# EAGLE design StickSoc_Right (EAGLE 6.6.0)
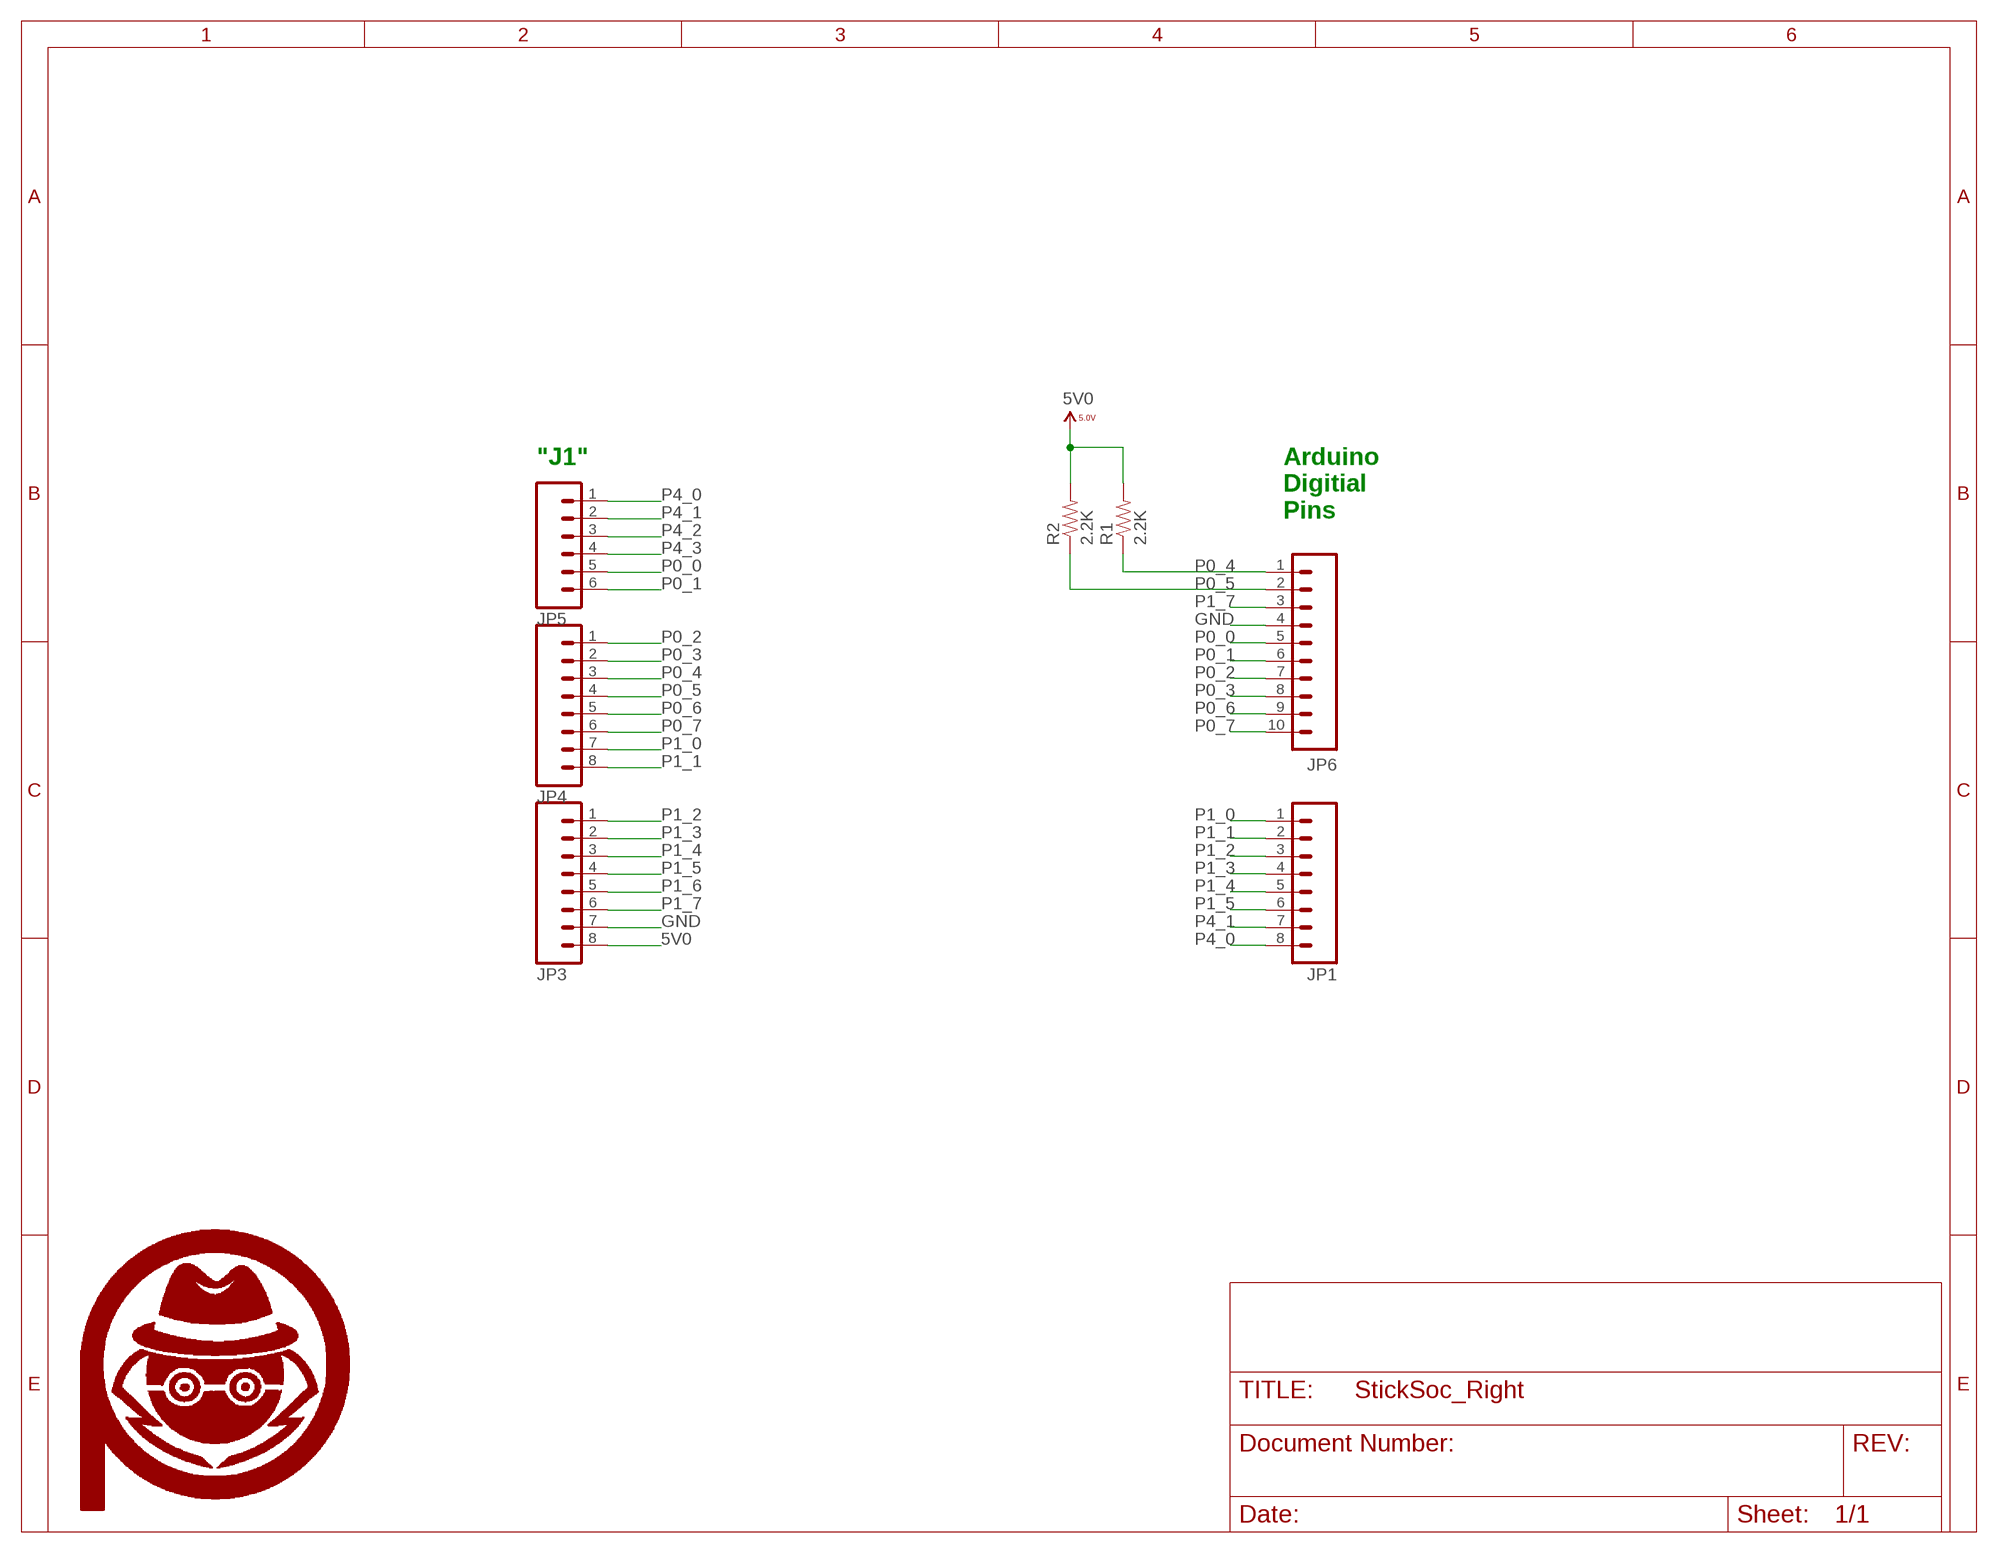
[diagram p0: schematic, sheet 1]

## Parts
JP1  M081X08  [1X08]
JP3  M081X08  [1X08]
JP4  M081X08  [1X08]
JP5  M06SIP  [1X06]
JP6  M10SILK_FEMALE_PTH  [1X10]
R1  2.2K  RESISTOR0805-RES  [0805]
R2  2.2K  RESISTOR0805-RES  [0805]
U$1  PA_LOGO_SYMSMALL  [PA_LOGO_AGENT_SMALL_SYM]
U$2  PA_LOGO_SYMSMALL  [PA_LOGO_AGENT_SMALL_SYM]

## Nets
5V0: JP3.8 R1.2 R2.2
GND: JP3.7 JP6.4
P0_0: JP5.5 JP6.5
P0_1: JP5.6 JP6.6
P0_2: JP4.1 JP6.7
P0_3: JP4.2 JP6.8
P0_4: JP4.3 JP6.1 R1.1
P0_5: JP4.4 JP6.2 R2.1
P0_6: JP4.5 JP6.9
P0_7: JP4.6 JP6.10
P1_0: JP1.1 JP4.7
P1_1: JP1.2 JP4.8
P1_2: JP1.3 JP3.1
P1_3: JP1.4 JP3.2
P1_4: JP1.5 JP3.3
P1_5: JP1.6 JP3.4
P1_6: JP3.5
P1_7: JP3.6 JP6.3
P4_0: JP1.8 JP5.1
P4_1: JP1.7 JP5.2
P4_2: JP5.3
P4_3: JP5.4

## Notes on the sheet
- "J1"
- Arduino
  Digitial
  Pins

## Library data of the parts
JP1 JP3 JP4 = moxdes_std:M08: Header 8 Standard 8-pin 0.1" header. Use with straight break away headers (SKU : PRT-00116), right angle break away headers (PRT-00553), swiss pins (PRT-00743), machine pins (PRT-00117), and female headers (PRT-00115).
JP5 = moxdes_std:M06: Header 6 Standard 6-pin 0.1" header. Use with straight break away headers (SKU : PRT-00116), right angle break away headers (PRT-00553), swiss pins (PRT-00743), machine pins (PRT-00117), and female headers (PRT-00115). Molex polarized connector foot print use with SKU : PRT-08094 with associated crimp pins and housings. NOTES ON THE VARIANTS LOCK and LOCK_LONGPADS... This footprint was designed to help hold the alignment of a through-hole component (i.e. 6-pin header) while soldering it into place. You may notice that each hole has been shifted either up or down by 0.005 of an inch from it's more standard position (which is a perfectly straight line). This slight alteration caused the pins (the squares in the middle) to touch the edges of the holes. Because they are alternating, it causes a "brace" to hold the component in place. 0.005 has proven to be the perfect amount of "off-center" position when using our standard breakaway headers. Although looks a little odd when you look at the bare footprint, once you have a header in there, the alteration is very hard to notice. Also, if you push a header all the way into place, it is covered up entirely on the bottom side. This idea of altering the position of holes to aid alignment will be further integrated into the Sparkfun Library for other footprints. It can help hold any component with 3 or more connection pins.
JP6 = SparkFun-Connectors:M10: Header 10 Standard 10-pin 0.1" header. Use with straight break away headers (SKU : PRT-00116), right angle break away headers (PRT-00553), swiss pins (PRT-00743), machine pins (PRT-00117), and female headers (PRT-00115).; PROD_ID: CONN-11563
R1 R2 = SparkFun-Passives:RESISTOR: Resistor Basic schematic elements and footprints for 0603, 1206, and PTH resistors.
U$1 U$2 = PatternAgents-Logos:PA_LOGO_SYM: PatternAgents Logo Symbol Trademark : PatternAgents, LLC Github : https://github.com/PatternAgents/PCB_Libraries License : http://creativecommons.org/licenses/by-sa/3.0/ (Creative Commons 3.0) THIS SOFTWARE IS PROVIDED BY THE CONTRIBUTORS "AS IS" AND WITHOUT ANY EXPRESS OR IMPLIED WARRANTIES, INCLUDING, BUT NOT LIMITED TO, THE IMPLIED WARRANTIES OF MERCHANTABILITY AND FITNESS FOR A PARTICULAR PURPOSE ARE DISCLAIMED. IN NO EVENT SHALL THE COPYRIGHT OWNER OR CONTRIBUTORS BE LIABLE FOR ANY DIRECT, INDIRECT, INCIDENTAL, SPECIAL, EXEMPLARY, OR CONSEQUENTIAL DAMAGES (INCLUDING, BUT NOT LIMITED TO, PROCUREMENT OF SUBSTITUTE GOODS OR SERVICES; LOSS OF USE, DATA, OR PROFITS; OR BUSINESS INTERRUPTION) HOWEVER CAUSED AND ON ANY THEORY OF LIABILITY, WHETHER IN CONTRACT, STRICT LIABILITY, OR TORT (INCLUDING NEGLIGENCE OR OTHERWISE) ARISING IN ANY WAY OUT OF THE USE OF THIS SOFTWARE, EVEN IF ADVISED OF THE POSSIBILITY OF SUCH DAMAGE.

## Board
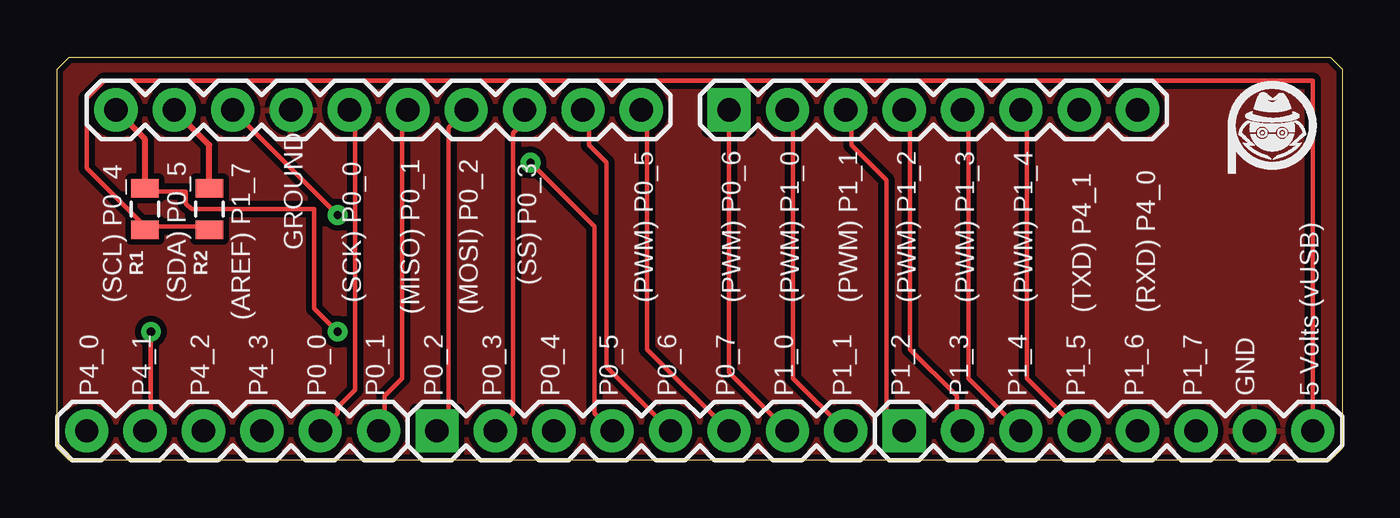
[diagram p1: board, top side]
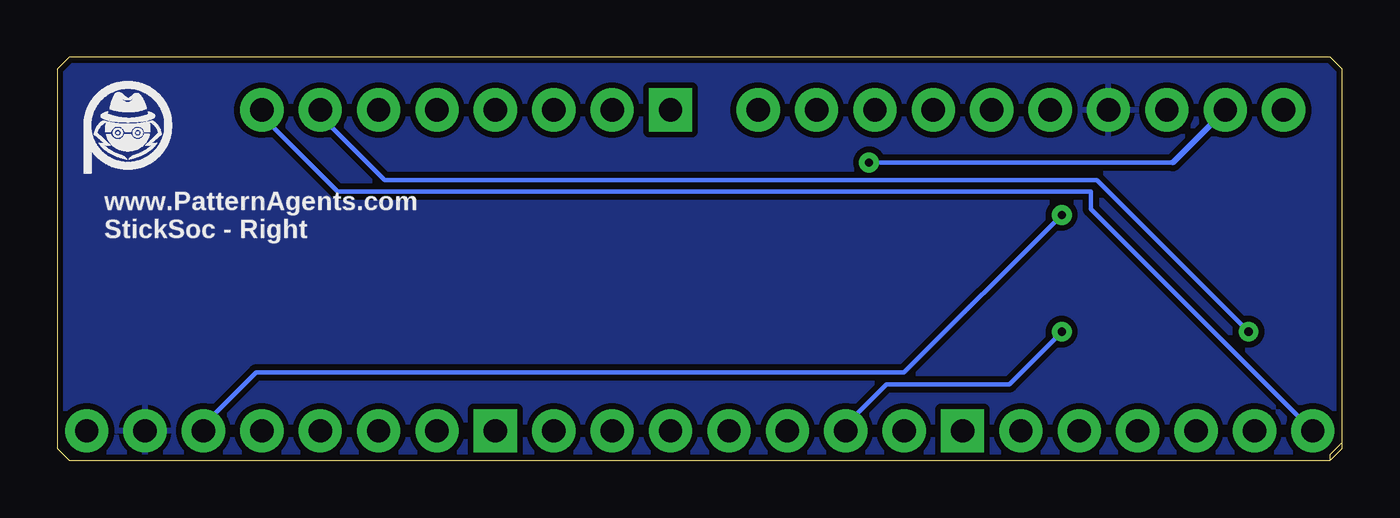
[diagram p2: board, bottom side, seen from below]

Size 55.88 x 17.53 mm. Coordinates in mm from the lower left corner, seen from the top.
Outline: 0.51,0 0.51,0.25 0,0.76
Outline: 0.51,0 0,0.51 0,17.02 0.51,17.53 55.37,17.53 55.88,17.02 55.88,0.51 55.37,0 0.51,0
Copper layers (1*16): Top 0.035mm / dielectric 1.5mm / Bottom 0.035mm
Design rules "PatternAgents": minimum track width 8mil, minimum drill 14mil, track to track 8mil, track to pad 8mil, pad to pad 8mil, via to via 8mil, smd to smd 8mil, copper to edge 10mil, drill to drill 8mil, minimum pad ring 12mil, minimum via ring 10mil, stop-mask expansion 4mil, vias tented up to drill 25mil, thermal gap 8mil

### Footprints (pad centres in the part's own frame; a part is rotated, then mirrored left to right if it is on the bottom)
1X08 = drill 1.016 pad 1.88 square: 1 0,0 | drill 1.016 pad 1.88: 2 2.54,0; 3 5.08,0; 4 7.62,0; 5 10.16,0; 6 12.7,0; 7 15.24,0; 8 17.78,0
1X06 = drill 1.016 pad 1.88: 1 0,0; 2 2.54,0; 3 5.08,0; 4 7.62,0; 5 10.16,0; 6 12.7,0
1X10 = drill 1.016 pad 1.88: 1 0,0; 2 2.54,0; 3 5.08,0; 4 7.62,0; 5 10.16,0; 6 12.7,0; 7 15.24,0; 8 17.78,0; 9 20.32,0; 10 22.86,0
0805 = smd 0.8 x 1.2: 1 -0.9,0; 2 0.9,0

### Placement (x,y rotation side)
JP1  29.21,15.24 0 top
JP3  36.83,1.27 0 top
JP4  16.51,1.27 0 top
JP5  1.27,1.27 0 top
JP6  2.54,15.24 0 top
R1  3.81,10.92 270 top
R2  6.6,10.92 270 top
U$1  52.83,14.22 0 top
U$2  52.83,14.22 0 bottom

### Tracks (layer width: path | path; a pad name or v marks a point on that pad's centre or on a via)
5V0
  Top 0.203: 3.81,10.16 6.6,10.16 R2.2 | 3.81,10.16 1.27,12.7 1.27,15.75 2.03,16.51 54.61,16.51 JP3.8 | 3.81,10.16 R1.2
GND
  pour Bottom (isolate 0.254, rank 2): 0,0 0,17.53 55.88,17.53 55.88,0
  pour Top (isolate 0.254, rank 2): 0,0 0,17.53 55.88,17.53 55.88,0
P0_0
  Top 0.203: JP5.5 12.19,2.03 12.19,2.29 12.95,3.05 12.95,14.99 JP6.5
P0_1
  Top 0.203: JP5.6 14.22,1.52 14.22,2.79 14.99,3.56 14.99,14.99 JP6.6
P0_2
  Top 0.203: JP4.1 17.02,1.78 17.02,14.48 JP6.7
P0_3
  Top 0.203: JP4.2 19.81,2.03 19.81,14.22 20.32,14.73 JP6.8
P0_4  (via drill 0.36)
  Top 0.203: v12.19,5.59 11.18,6.6 11.18,10.92 5.84,10.92 5.59,11.18 5.59,11.68 3.81,11.68 R1.1
  Top 0.254: R1.1 3.81,13.97 JP6.1
  Bottom 0.203: v12.19,5.59 14.48,3.3 19.81,3.3 21.59,1.52 JP4.3
P0_5  (via drill 0.36)
  Top 0.203: v20.57,12.95 23.37,10.16 23.37,2.03 JP4.4
  Top 0.254: R2.1 6.6,13.72 JP6.2
  Bottom 0.203: v20.57,12.95 7.37,12.95
  Bottom 0.254: 7.37,12.95 JP6.2
P0_6
  Top 0.203: JP4.5 23.88,4.06 23.88,12.95 23.11,13.72 23.11,14.99 JP6.9
P0_7
  Top 0.203: JP4.6 25.65,4.83 25.65,14.99 JP6.10
P1_0
  Top 0.203: JP4.7 29.21,3.81 JP1.1
P1_1
  Top 0.203: JP4.8 32,3.56 32,14.99 JP1.2
P1_2
  Top 0.203: JP3.1 36.07,2.03 36.07,12.19 34.54,13.72 34.54,14.99 JP1.3
P1_3
  Top 0.203: JP3.2 39.12,1.52 39.12,2.79 37.08,4.83 37.08,14.99 JP1.4
P1_4
  Top 0.203: JP3.3 39.62,3.56 39.62,14.99 JP1.5
P1_5
  Top 0.203: JP3.4 42.16,3.56 42.16,14.99 JP1.6
P1_7  (via drill 0.36)
  Top 0.203: v12.19,10.67 JP6.3
  Bottom 0.203: v12.19,10.67 19.05,3.81 47.24,3.81 49.53,1.52 JP3.6
P4_0
  Bottom 0.203: JP5.1 10.92,10.92 10.92,11.68 43.69,11.68 46.99,14.99 JP1.8
P4_1  (via drill 0.36)
  Top 0.203: JP5.2 4.06,1.52 v4.06,5.59
  Bottom 0.203: v4.06,5.59 10.67,12.19 41.66,12.19 44.45,14.99 JP1.7

### Text on the board
tPlace: GROUND | (SS) P0_3 | (SCL) P0_4 | (SDA) P0_5 | (SCK) P0_0 | (PWM) P0_5 | (PWM) P0_6 | (PWM) P1_0 | (PWM) P1_1 | (PWM) P1_2 | (PWM) P1_3 | (PWM) P1_4 | (AREF) P1_7 | (MISO) P0_1 | (MOSI) P0_2 | (TXD) P4_1 | (RXD) P4_0 | P4_0 | P4_1 | P4_2 | P4_3 | P0_0 | P0_1 | P0_2 | P0_3 | P0_4 | P0_5 | P0_6 | P0_7 | P1_0 | P1_1 | P1_2 | P1_3 | P1_4 | P1_5 | P1_6 | P1_7 | GND | 5 Volts (vUSB)
bPlace: www.PatternAgents.com / StickSoc - Right